# Altium schematic sheet electronic_dc_load_v1.SchDoc: Electronic DC Load (part 3 of 3)
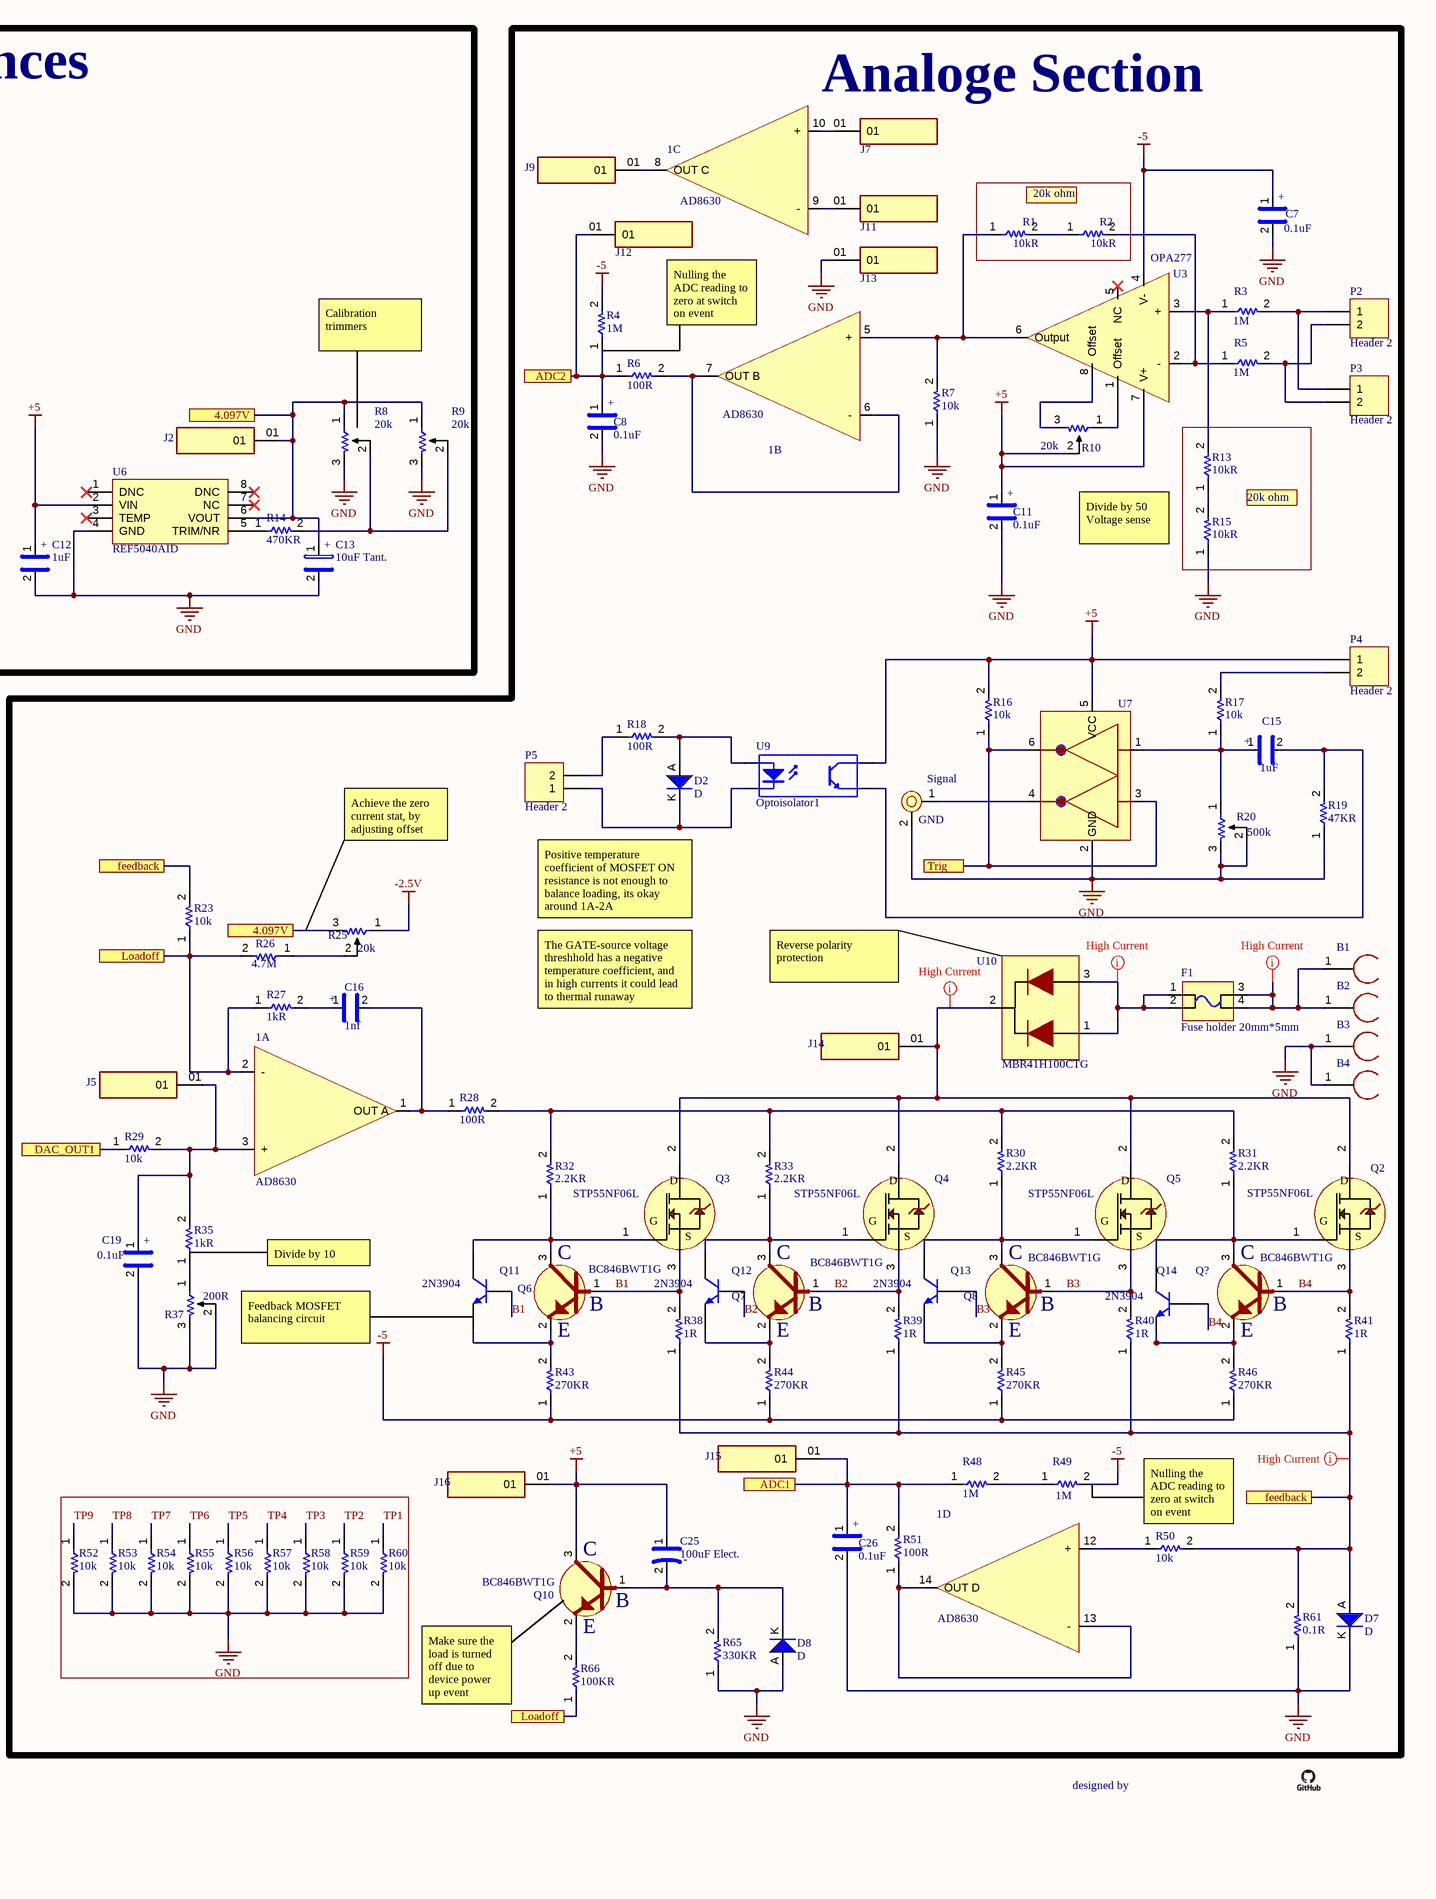
[diagram p3: electronic_dc_load_v1.SchDoc, right]

## Library data of the parts (continued)
R37 = 200R: GLOVE, POLYAMIDE, L/FREE, PU, SIZE 6 - More Details; Manufacturer: Bourns; Manufacturer Part Number: 3296Y-1-201LF; Tolerance: 10%; Power Rating: 500mW; Voltage Rating: 300V; Number of Turns: 25; Temperature Coefficient: 100ppm/°C; Lead Diameter: 0.5mm; Supplier 1: Digi-Key; RoHS: Yes; Category: Variable Resistors and Potentiometers; Stock 1: 3; Pricing 1: 1=2.41000, 10=2.11700, 25=1.89800, 50=1.82500, 100=1.75200, 250=1.67900, 500=1.38700, 1000=1.31400, 5000=1.09500 (USD); Mount: Through Hole,Panel,PCB; Weight: 0.03oz; Color: Blue; Min Operating Temperature: -55°C; Max Operating Temperature: 125°C; Resistance: 200R; Packaging: Rail/Tube; Package Quantity: 50; Voltage Rating (DC): 300V; Resistor Type: Cermet; Termination: Pin; Taper: Linear; Max Power Dissipation: 500mW; Series: 3296; Technology: CERMET; Resistance Tolerance: 10%; Length: 9.53mm; Width: 9.53mm; Height: 0.395inch; Depth: 4.83mm; Radiation Hardening: No; REACH SVHC: No SVHC; Military Standard: Not; Lead Free: Lead Free; RoHS Compliant: Yes; ComponentLink1URL: https://datasheet.ciiva.com/11831/0900766b8069ccf4-11831017.pdf?src-supplier=RSComponents; ComponentLink1Description: https://datasheet.ciiva.com/11831/0900766b8069ccf4-11831017.pdf?src-supplier=RSComponents; ComponentLink2URL: https://datasheet.ciiva.com/29122/447304-da-01-en-trimmer-tht3296y-1-201lf-200r-0-5w-29122391.pdf?src-supplier=Conrad; ComponentLink2Description: https://datasheet.ciiva.com/29122/447304-da-01-en-trimmer-tht3296y-1-201lf-200r-0-5w-29122391.pdf?src-supplier=Conrad; ComponentLink3URL: https://datasheet.ciiva.com/16716/70153578-16716822.pdf?src-supplier=Allied+Electronics; ComponentLink3Description: https://datasheet.ciiva.com/16716/70153578-16716822.pdf?src-supplier=Allied+Electronics; ComponentLink4URL: https://datasheet.ciiva.com/30066/3296-30066951.pdf?src-supplier=Onlinecomponents.com; ComponentLink4Description: https://datasheet.ciiva.com/30066/3296-30066951.pdf?src-supplier=Onlinecomponents.com; ComponentLink5URL: https://datasheet.ciiva.com/2158/3296-2158313.pdf?src-supplier=Digi-Key; ComponentLink5Description: https://datasheet.ciiva.com/2158/3296-2158313.pdf?src-supplier=Digi-Key; ComponentLink6URL: https://datasheet.ciiva.com/1131/1815117-1131451.pdf?src-supplier=Element14; ComponentLink6Description: https://datasheet.ciiva.com/1131/1815117-1131451.pdf?src-supplier=Element14; ComponentLink7URL: https://datasheet.ciiva.com/14173/dabourns3296-data-e-14173005.pdf?src-supplier=Distrelec; ComponentLink7Description: https://datasheet.ciiva.com/14173/dabourns3296-data-e-14173005.pdf?src-supplier=Distrelec; Supplier Part Number 1: 3296Y-201LF-ND
R38-R41 = 1R: RES 1 OHM 5W 1% AXIAL; Manufacturer: Vishay BCcomponents; Manufacturer Part Number: PAC500001008FAC000; Temperature Coefficient: 100ppm/°C; Supplier 1: Mouser; RoHS: Yes; Category: Through-Hole Resistors; Stock 1: 101; Pricing 1: 1=1.28000, 10=0.95500, 50=0.95500, 100=0.69800, 1000=0.48800, 10000=0.45600 (USD); Mount: Through Hole; Case/Package: Conformal; Contact Plating: Tin; Min Operating Temperature: -55°C; Max Operating Temperature: 275°C; Package Quantity: 1; Resistance: 1R; Power Rating: 5W; Tolerance: 1%; Packaging: Tape and Reel; Resistor Type: Wirewound; Number of Terminations: 2; Termination: Axial; Max Power Dissipation: 5W; Features: Flame Retardant Coating; Series: PAC; Construction: Cylindrical; Diameter: 7.5mm; Length: 26mm; Radiation Hardening: No; Military Standard: Not; RoHS Compliant: Yes; ComponentLink1URL: https://datasheet.ciiva.com/2720/pacserie-2720053.pdf?src-supplier=Digi-Key; ComponentLink1Description: https://datasheet.ciiva.com/2720/pacserie-2720053.pdf?src-supplier=Digi-Key; ComponentLink2URL: https://datasheet.ciiva.com/2720/pacserie-2720054.pdf?src-supplier=Digi-Key; ComponentLink2Description: https://datasheet.ciiva.com/2720/pacserie-2720054.pdf?src-supplier=Digi-Key; ComponentLink3URL: https://datasheet.ciiva.com/8401/pacserie-8401197.pdf?src-supplier=Avnet; ComponentLink3Description: https://datasheet.ciiva.com/8401/pacserie-8401197.pdf?src-supplier=Avnet; Supplier Part Number 1: 71-PAC500001008FAC00
R43-R46 = 270KR: 270KR ±0.1%  0.25W
R61 = 0.1R: BOURNS - PWR220T-35-R100F - RESISTOR, POWER, 0.1R, 0.01, 35W; Resistance: 100mR; Tolerance: 1%; Voltage Rating: 2kV; Threshold Voltage: 1.4V; Temperature Coefficient: 100ppm/°C; Voltage Rating (DC): 250V; Lead Diameter: 0.72mm; Supplier 1: Digi-Key; Manufacturer: Bourns; Manufacturer Part Number: PWR220T-35-R100F; RoHS: Yes; Category: Through-Hole Resistors; Stock 1: 660; Pricing 1: 1=4.48000, 10=4.05400, 100=3.01880, 1000=2.17350, 2500=2.13900 (USD); Case/Package: TO-220; Min Operating Temperature: -55°C; Max Operating Temperature: 155°C; Power Rating: 35W; Packaging: Rail/Tube; Package Quantity: 50; Resistor Type: Thick Film; Number of Terminations: 2; Termination: Radial; Max Power Dissipation: 35W; Features: Automotive AEC-Q200; Series: PWR220T-35; Resistance Tolerance: 1%; Construction: Rectangular; Technology: THICK FILM; Length: 10.1mm; Width: 0.157inch; Height: 14.6mm; Lead Pitch: 5.08mm; Depth: 4mm; REACH SVHC: No SVHC; Military Standard: Not; RoHS Compliant: Yes; ComponentLink1URL: https://datasheet.ciiva.com/7986/1869472-7986042.pdf?src-supplier=Element14; ComponentLink1Description: https://datasheet.ciiva.com/7986/1869472-7986042.pdf?src-supplier=Element14; Supplier Part Number 1: PWR220T-35-R100F-ND
R65 = 330KR: 330K ohms ±0.1%  0.25W
R66 = 100KR: 100K ±0.1%  0.25W
SW1 = SW-SPST: Single-Pole, Single-Throw Switch; Published: 24-Mar-1999; LatestRevisionDate: 17-Jul-2002; LatestRevisionNote: Re-released for DXP Platform.; PackageReference: SPST-2; Publisher: Altium Limited; PackageDescription: Switch; 2 Leads
SW2 = FSM4JSMA: Switch Tactile OFF (ON) SPST Round Button Gull Wing 0.05A 24VDC 2.6N SMD T/R; MF: {'manufacturer': u'TE Connectivity'}; Value: *; Price: None; Availability: Unavailable; Package: None; MP: FSM4JSMA
U1 = LM7812CT: Fairchild Semiconductor; Manufacturer: ON Semiconductor / Fairchild; Dropout Voltage: 2V; Quiescent Current: 8mA; Number of Outputs: 1; Max Input Voltage: 35V; Max Output Current: 1A; Output Voltage: 12V; Polarity: Positive; Accuracy: 4%; Output Type: Fixed; Min Input Voltage: 14.5V; Power Supply Rejection Ratio (PSRR): 71dB; Supplier 1: Avnet; Manufacturer Part Number: LM7812CT; RoHS: Yes; Category: Voltage Regulators - Linear; Stock 1: 6000; Mount: Through Hole; Case/Package: TO-220-3; Number of Pins: 3; Weight: 1.214g; Contact Plating: Tin,Matte; Min Operating Temperature: -40°C; Max Operating Temperature: 125°C; Output Current: 1A; Packaging: Rail/Tube; Package Quantity: 50; Number of Regulators: 1; Output Voltage Accuracy: 4%; Nominal Output Voltage: 12V; Min Output Voltage: 12V; Length: 10.16mm; Width: 4.7mm; Height: 8.89mm; Radiation Hardening: No; Lead Free: Lead Free; RoHS Compliant: Yes; REACH SVHC: No SVHC; ComponentLink1URL: https://datasheet.ciiva.com/26908/lm7812ct-26908840.pdf?src-supplier=IIIC; ComponentLink1Description: https://datasheet.ciiva.com/26908/lm7812ct-26908840.pdf?src-supplier=IIIC; ComponentLink2URL: https://datasheet.ciiva.com/2039/lm7805-2039371.pdf?src-supplier=Digi-Key; ComponentLink2Description: https://datasheet.ciiva.com/2039/lm7805-2039371.pdf?src-supplier=Digi-Key; ComponentLink3URL: https://datasheet.ciiva.com/25974/lm7812-25974492.pdf?src-supplier=Avnet+Europe; ComponentLink3Description: https://datasheet.ciiva.com/25974/lm7812-25974492.pdf?src-supplier=Avnet+Europe; Supplier Part Number 1: LM7812CT
U2 = LM7805CT: Standard Regulator Pos 5V 2.2A 3-Pin(3+Tab) TO-220AB Rail; Manufacturer: ON Semiconductor / Fairchild; Quiescent Current: 8mA; Dropout Voltage: 2V; Number of Outputs: 1; Output Current: 1A; Output Type: Fixed; Max Input Voltage: 35V; Polarity: Positive; Min Input Voltage: 7V; Accuracy: 4%; Power Supply Rejection Ratio (PSRR): 73dB; Max Output Voltage: 5.2V; Manufacturer Part Number: LM7805CT; RoHS: Yes; Category: Voltage Regulators - Linear; Stock 1: 9559; Pricing 1: 331=1.02898, 340=1.02141, 670=1.01384, 1700=1.00628, 3400=0.99871, 17000=0.99115, 34000=0.98358 (USD); Mount: Through Hole; Case/Package: TO-220-3; Number of Pins: 3; Weight: 1.214g; Min Operating Temperature: -40°C; Max Operating Temperature: 125°C; Output Voltage: 5V; Packaging: Rail/Tube; Package Quantity: 50; Max Output Current: 1A; Number of Regulators: 1; Output Voltage Accuracy: 4%; Current Rating: 1A; Nominal Output Voltage: 5V; Min Output Voltage: 5V; Length: 10.67mm; Width: 4.7mm; Height: 16.3mm; Radiation Hardening: No; RoHS Compliant: Yes; Lead Free: Lead Free; REACH SVHC: No SVHC; ComponentLink1URL: https://datasheet.ciiva.com/19456/786138-19456361.pdf?src-supplier=Jameco; ComponentLink1Description: https://datasheet.ciiva.com/19456/786138-19456361.pdf?src-supplier=Jameco; ComponentLink2URL: https://datasheet.ciiva.com/26904/lm7805ct-26904988.pdf?src-supplier=IIIC; ComponentLink2Description: https://datasheet.ciiva.com/26904/lm7805ct-26904988.pdf?src-supplier=IIIC; ComponentLink3URL: https://datasheet.ciiva.com/2039/lm7805-2039365.pdf?src-supplier=Digi-Key; ComponentLink3Description: https://datasheet.ciiva.com/2039/lm7805-2039365.pdf?src-supplier=Digi-Key; ComponentLink4URL: https://datasheet.ciiva.com/8239/lm7812-8239478.pdf?src-supplier=Avnet; ComponentLink4Description: https://datasheet.ciiva.com/8239/lm7812-8239478.pdf?src-supplier=Avnet; ComponentLink5URL: https://datasheet.ciiva.com/1512/1855686-1512106.pdf?src-supplier=Element14; ComponentLink5Description: https://datasheet.ciiva.com/1512/1855686-1512106.pdf?src-supplier=Element14; ComponentLink6URL: https://datasheet.ciiva.com/17332/lm7805-17332792.pdf?src-supplier=Future+Electronics; ComponentLink6Description: https://datasheet.ciiva.com/17332/lm7805-17332792.pdf?src-supplier=Future+Electronics; ComponentLink7URL: https://datasheet.ciiva.com/1512/1855686-1512105.pdf?src-supplier=Element14; ComponentLink7Description: https://datasheet.ciiva.com/1512/1855686-1512105.pdf?src-supplier=Element14; ComponentLink8URL: https://datasheet.ciiva.com/1511/1855686-1511835.pdf?src-supplier=Element14; ComponentLink8Description: https://datasheet.ciiva.com/1511/1855686-1511835.pdf?src-supplier=Element14; ComponentLink9URL: https://datasheet.ciiva.com/48694/001253095-da-01-en-ic-reg-ldo-5v-1a-lm7805ct-to-220-3-fsc-48694790.pdf?src-supplier=Conrad; ComponentLink9Description: https://datasheet.ciiva.com/48694/001253095-da-01-en-ic-reg-ldo-5v-1a-lm7805ct-to-220-3-fsc-48694790.pdf?src-supplier=Conrad; Supplier Part Number 1: LM7805CT; Supplier 1: Avnet
U3 = OPA277: Operational Amplifier Single 1 MHz SO-8, OPA277UA, Texas Instruments; Voltage Gain: 140dB; Nominal Supply Current: 825uA; Common Mode Rejection Ratio: 115dB; Number of Channels: 1; Slew Rate: 0.8V/µs; Input Offset Voltage (Vos): 20uV; Min Dual Supply Voltage: 2V; Max Dual Supply Voltage: 18V; Bandwidth: 1MHz; Input Bias Current: 2.8nA; Operating Supply Current: 790uA; Output Current per Channel: 35mA; Max I/O Voltage: 50uV; Dual Supply Voltage: 9V; Supplier 1: Digi-Key; Manufacturer: Texas Instruments; Manufacturer Part Number: OPA277UA; RoHS: Yes; Category: Amplifiers - Op Amps, Buffer, Instrumentation; Stock 1: 3292; Pricing 1: 1=3.72000, 10=3.34300, 25=3.16000, 100=2.73880, 250=2.59832, 500=2.33148, 1000=2.21275 (USD); Case/Package: D; Number of Pins: 8; Contact Plating: Gold; Min Operating Temperature: -40°C; Max Operating Temperature: 85°C; Package Quantity: 75; Packaging: Rail/Tube; Number of Circuits: 1; Gain Bandwidth Product: 1MHz; Number of Elements: 1; Unity Gain Bandwidth Product: 1MHz; Nominal Gain Bandwidth Product: 1MHz; Max Supply Voltage: 18V; Number of Amplifiers: 1; Length: 4.9mm; Width: 3.91mm; Height: 1.58mm; Radiation Hardening: No; Lead Free: Lead Free; RoHS Compliant: Yes; REACH SVHC: No SVHC; ComponentLink1URL: https://datasheet.ciiva.com/2973/opa4277-2973984.pdf?src-supplier=Avnet; ComponentLink1Description: https://datasheet.ciiva.com/2973/opa4277-2973984.pdf?src-supplier=Avnet; ComponentLink2URL: https://datasheet.ciiva.com/1799/opa277-1799267.pdf?src-supplier=Digi-Key; ComponentLink2Description: https://datasheet.ciiva.com/1799/opa277-1799267.pdf?src-supplier=Digi-Key; ComponentLink3URL: https://datasheet.ciiva.com/7738/1830880-7738390.pdf?src-supplier=Element14; ComponentLink3Description: https://datasheet.ciiva.com/7738/1830880-7738390.pdf?src-supplier=Element14; ComponentLink4URL: https://datasheet.ciiva.com/26243/opa4277-26243593.pdf?src-supplier=Avnet+Europe; ComponentLink4Description: https://datasheet.ciiva.com/26243/opa4277-26243593.pdf?src-supplier=Avnet+Europe; Supplier Part Number 1: OPA277UA-ND
U4 = LM431ACMX: V-Ref Adjustable 2.5V to 36V 100mA 8-Pin SOP T/R; Manufacturer: ON Semiconductor / Fairchild; Number of Channels: 1; Tolerance: 2%; Temperature Coefficient: 50ppm/°C; Cathode Current: 1mA; Reference Type: Shunt,Adjustable; Supplier 1: Avnet; Manufacturer Part Number: LM431ACMX; RoHS: Yes; Category: Voltage References; Stock 1: 40099; Mount: Surface Mount; Case/Package: SOP; Number of Pins: 8; Weight: 0.2304g; Min Operating Temperature: -25°C; Max Operating Temperature: 85°C; Max Input Voltage: 36V; Packaging: Tape and Reel; Package Quantity: 3000; Output Voltage: 36V; Max Output Current: 100mA; Max Output Voltage: 36V; Output Current: 100mA; Current Rating: 100mA; Series: -; Min Output Voltage: 2.5V; Output Type: Adjustable; RoHS Compliant: Yes; Lead Free: Lead Free; ComponentLink1URL: https://datasheet.ciiva.com/4908/lm431a-189989-4908452.pdf?src-supplier=Mouser; ComponentLink1Description: https://datasheet.ciiva.com/4908/lm431a-189989-4908452.pdf?src-supplier=Mouser; ComponentLink2URL: https://datasheet.ciiva.com/29571/lm431a-29571926.pdf?src-supplier=Digi-Key; ComponentLink2Description: https://datasheet.ciiva.com/29571/lm431a-29571926.pdf?src-supplier=Digi-Key; ComponentLink3URL: https://datasheet.ciiva.com/29571/lm431a-29571925.pdf?src-supplier=Digi-Key; ComponentLink3Description: https://datasheet.ciiva.com/29571/lm431a-29571925.pdf?src-supplier=Digi-Key; ComponentLink4URL: https://datasheet.ciiva.com/9215/lm431c-9215048.pdf?src-supplier=Avnet; ComponentLink4Description: https://datasheet.ciiva.com/9215/lm431c-9215048.pdf?src-supplier=Avnet; Supplier Part Number 1: LM431ACMX
U5 = LTC1046: LINEAR TECHNOLOGY - LTC1046CS8#PBF - VOLT CONVERTER, SMD, SOIC8, 1046; Manufacturer: Analog Devices / Linear Technology; Number of Outputs: 1; Output Voltage: 3V; Output Current: 50mA; Synchronous Rectifier: No; Min Input Voltage: 1.5V; Switching Frequency: 30kHz; Max Input Voltage: 6V; Operating Supply Current: 165uA; Output Type: Adjustable; Min Output Voltage: -6V; Max Output Voltage: -1.5V; Supplier 1: Digi-Key; Manufacturer Part Number: LTC1046CS8#PBF; RoHS: Yes; Category: Voltage Regulators - Switching; Stock 1: 46; Pricing 1: 1=6.96000, 10=6.29000, 25=5.99760, 100=5.20760, 250=4.97352, 500=4.53468, 1000=4.14000 (USD); Case/Package: SOIC; Number of Pins: 8; Min Operating Temperature: 0°C; Max Operating Temperature: 70°C; Packaging: Cut Tape; Package Quantity: 100; Series: -; Max Output Current: 50mA; Max Supply Voltage: 6V; Min Supply Voltage: 1.5V; Length: 5mm; Width: 3.988mm; Height: 1.498mm; Radiation Hardening: No; RoHS Compliant: Yes; Lead Free: Lead Free; REACH SVHC: No SVHC; ComponentLink1URL: https://datasheet.ciiva.com/2024/2898-2024864.pdf?src-supplier=Digi-Key; ComponentLink1Description: https://datasheet.ciiva.com/2024/2898-2024864.pdf?src-supplier=Digi-Key; ComponentLink2URL: https://datasheet.ciiva.com/30477/0900766b8125257c-30477616.pdf?src-supplier=RSComponents; ComponentLink2Description: https://datasheet.ciiva.com/30477/0900766b8125257c-30477616.pdf?src-supplier=RSComponents; ComponentLink3URL: https://datasheet.ciiva.com/15114/getdatasheetpartid-135603-15114038.pdf?src-supplier=Verical; ComponentLink3Description: https://datasheet.ciiva.com/15114/getdatasheetpartid-135603-15114038.pdf?src-supplier=Verical; ComponentLink4URL: https://datasheet.ciiva.com/19474/1745629-19474318.pdf?src-supplier=Jameco; ComponentLink4Description: https://datasheet.ciiva.com/19474/1745629-19474318.pdf?src-supplier=Jameco; ComponentLink5URL: https://datasheet.ciiva.com/26898/ltc1046cs8-pbf-26898654.pdf?src-supplier=IIIC; ComponentLink5Description: https://datasheet.ciiva.com/26898/ltc1046cs8-pbf-26898654.pdf?src-supplier=IIIC; ComponentLink6URL: https://datasheet.ciiva.com/6185/1573420-6185372.pdf?src-supplier=Farnell; ComponentLink6Description: https://datasheet.ciiva.com/6185/1573420-6185372.pdf?src-supplier=Farnell; Supplier Part Number 1: LTC1046CS8#PBF-ND
U6 = REF5040AID: IC VREF SERIES 4.096V 8SOIC; Manufacturer: Texas Instruments; Max Input Voltage: 18V; Max Output Current: 10mA; Min Input Voltage: 4.296V; Tolerance: 0.1%; Temperature Coefficient: 3ppm/°C; Quiescent Current: 1mA; Reference Type: Series,Fixed; Number of Channels: 1; Operating Supply Current: 800uA; Operating Supply Voltage: 24V; Supplier 1: Mouser; Manufacturer Part Number: REF5040AID; RoHS: Yes; Category: Voltage References; Stock 1: 277; Pricing 1: 1=4.08000, 10=3.67000, 50=3.47000, 100=3.47000, 1000=3.47000, 10000=3.47000 (USD); Case/Package: D; Number of Pins: 8; Weight: 0.002677oz; Min Operating Temperature: -40°C; Max Operating Temperature: 125°C; Output Voltage: 4.096V; Packaging: Rail/Tube; Package Quantity: 75; Output Current: 10mA; Max Output Voltage: 4.096V; Reference Voltage: 4.096V; Length: 5mm; Width: 4mm; Height: 1.5mm; Radiation Hardening: No; Lead Free: Lead Free; RoHS Compliant: Yes; REACH SVHC: No SVHC; ComponentLink1URL: https://datasheet.ciiva.com/2007/ref5020-2007515.pdf?src-supplier=Digi-Key; ComponentLink1Description: https://datasheet.ciiva.com/2007/ref5020-2007515.pdf?src-supplier=Digi-Key; ComponentLink2URL: https://datasheet.ciiva.com/3235/ref5050-3235581.pdf?src-supplier=Avnet; ComponentLink2Description: https://datasheet.ciiva.com/3235/ref5050-3235581.pdf?src-supplier=Avnet; Supplier Part Number 1: 595-REF5040AID
U7 = SN74LVC2G14DBVR: INVERTER SCHMITT TRIGGER, SOT-23-6, FULL REEL; Logic Type:Inverter Schmitt Trigger; Output Current:32mA; No. of Inputs:1; Supply Voltage Min:1.65V; Supply Voltage Max:5.5V; Logic Case Style:SOT-23; No. of Pins:6; Family Type:LVC ;RoHS Compliant: Yes; Manufacturer: Texas Instruments; Number of Inputs: 1; Propagation Delay: 9.5ns; Max Supply Voltage: 5.5V; Min Supply Voltage: 1.65V; Output Current: 32mA; Logic Function: Buffer,Inverter,Inverting,Schmitt Trigger; Number of Elements: 2; Quiescent Current: 10uA; High Level Output Current: -32mA; Turn-On Delay Time: 4.3ns; Supplier 1: Digi-Key; Manufacturer Part Number: SN74LVC2G14DBVR; RoHS: Yes; Category: Logic Gates; Stock 1: 686; Pricing 1: 1=0.43000, 10=0.32300, 25=0.29160, 100=0.20140, 250=0.16960, 500=0.13780, 1000=0.10600 (USD); Mount: Surface Mount; Case/Package: SOT-23; Number of Pins: 6; Weight: 0.000557oz; Contact Plating: Tin,Matte; Min Operating Temperature: -40°C; Max Operating Temperature: 125°C; Package Quantity: 3000; Packaging: Tape and Reel; Max Output Current: 32mA; Number of Circuits: 2; Low Level Output Current: 32mA; Termination: SMD/SMT; Number of Gates: 2; Number of Bits: 2; Schmitt Trigger Input: Yes; Length: 2.9mm; Width: 1.6mm; Height: 1.15mm; Radiation Hardening: No; REACH SVHC: No SVHC; Lead Free: Lead Free; RoHS Compliant: Yes; ComponentLink1URL: https://datasheet.ciiva.com/4827/sn74lvc2g14-50958-4827361.pdf?src-supplier=Mouser; ComponentLink1Description: https://datasheet.ciiva.com/4827/sn74lvc2g14-50958-4827361.pdf?src-supplier=Mouser; ComponentLink2URL: https://datasheet.ciiva.com/28540/1772571-28540805.pdf?src-supplier=Element14; ComponentLink2Description: https://datasheet.ciiva.com/28540/1772571-28540805.pdf?src-supplier=Element14; ComponentLink3URL: https://datasheet.ciiva.com/15089/getdatasheetpartid-44147-15089068.pdf?src-supplier=Verical; ComponentLink3Description: https://datasheet.ciiva.com/15089/getdatasheetpartid-44147-15089068.pdf?src-supplier=Verical; ComponentLink4URL: https://datasheet.ciiva.com/34301/1046238-34301917.pdf?src-supplier=Jameco; ComponentLink4Description: https://datasheet.ciiva.com/34301/1046238-34301917.pdf?src-supplier=Jameco; ComponentLink5URL: https://datasheet.ciiva.com/1864/sn74lvc2g14-1864305.pdf?src-supplier=Digi-Key; ComponentLink5Description: https://datasheet.ciiva.com/1864/sn74lvc2g14-1864305.pdf?src-supplier=Digi-Key; ComponentLink6URL: https://datasheet.ciiva.com/1864/sn74lvc2g14-1864306.pdf?src-supplier=Digi-Key; ComponentLink6Description: https://datasheet.ciiva.com/1864/sn74lvc2g14-1864306.pdf?src-supplier=Digi-Key; ComponentLink7URL: https://datasheet.ciiva.com/1864/sn74lvc2g14-1864307.pdf?src-supplier=Digi-Key; ComponentLink7Description: https://datasheet.ciiva.com/1864/sn74lvc2g14-1864307.pdf?src-supplier=Digi-Key; ComponentLink8URL: https://datasheet.ciiva.com/14288/sn74lvc2g14-14288309.pdf?src-supplier=Avnet; ComponentLink8Description: https://datasheet.ciiva.com/14288/sn74lvc2g14-14288309.pdf?src-supplier=Avnet; ComponentLink9URL: https://datasheet.ciiva.com/26042/sn74lvc2g14-26042406.pdf?src-supplier=Avnet+Europe; ComponentLink9Description: https://datasheet.ciiva.com/26042/sn74lvc2g14-26042406.pdf?src-supplier=Avnet+Europe; ComponentLink10URL: https://datasheet.ciiva.com/7783/1768119-7783611.pdf?src-supplier=Element14; ComponentLink10Description: https://datasheet.ciiva.com/7783/1768119-7783611.pdf?src-supplier=Element14; ComponentLink11URL: https://datasheet.ciiva.com/7783/1768119-7783612.pdf?src-supplier=Element14; ComponentLink11Description: https://datasheet.ciiva.com/7783/1768119-7783612.pdf?src-supplier=Element14; Supplier Part Number 1: 296-13010-1-ND
U8 = GLCD: Grapghic LCD based  on st7920  controller  128x64
U9 U11 = Optoisolator1: 4-Pin Phototransistor Optocoupler; Published: 24-Mar-1999; LatestRevisionDate: 04-Mar-2005; LatestRevisionNote: Sch pins 3 & 4 Swapped.; DatasheetVersion: Nov-2003; PackageReference: DIP-4; Publisher: Altium Limited
U10 = MBR41H100CTG: DIODE ARRAY SCHOTTKY 100V TO220; Manufacturer: ON Semiconductor; Forward Current: 20A; Max Reverse Current: 10uA; Max Surge Current: 350A; Forward Voltage: 900mV; Element Configuration: Common Cathode; Supplier 1: Digi-Key; Manufacturer Part Number: MBR41H100CTG; RoHS: Yes; Category: Schottky Diodes; Stock 1: 220; Pricing 1: 1=2.14000, 10=1.92400, 100=1.54640, 500=1.27050, 1000=1.05270, 2000=0.99000 (USD); Case/Package: TO-220-3; Number of Pins: 3; Min Operating Temperature: -65°C; Max Operating Temperature: 175°C; Package Quantity: 50; Packaging: Rail/Tube; Average Rectified Current: 20A; Max Reverse Leakage Current: 10uA; Max Repetitive Reverse Voltage (Vrrm): 100V; Peak Non-Repetitive Surge Current: 350A; Max Forward Surge Current (Ifsm): 350A; Current Rating: 20A; Voltage Rating (DC): 100V; Max Reverse Voltage (DC): 100V; Series: SWITCHMODE™; Length: 10.28mm; Width: 4.82mm; Height: 15.75mm; Radiation Hardening: No; REACH SVHC: No SVHC; Lead Free: Lead Free; RoHS Compliant: Yes; ComponentLink1URL: https://datasheet.ciiva.com/908/mbr41h100ct-d-908465.pdf?src-supplier=Avnet; ComponentLink1Description: https://datasheet.ciiva.com/908/mbr41h100ct-d-908465.pdf?src-supplier=Avnet; ComponentLink2URL: https://datasheet.ciiva.com/30479/0900766b812212ba-30479299.pdf?src-supplier=RSComponents; ComponentLink2Description: https://datasheet.ciiva.com/30479/0900766b812212ba-30479299.pdf?src-supplier=RSComponents; ComponentLink3URL: https://datasheet.ciiva.com/7962/mbr41h100ct-d-7962757.pdf?src-supplier=Element14; ComponentLink3Description: https://datasheet.ciiva.com/7962/mbr41h100ct-d-7962757.pdf?src-supplier=Element14; ComponentLink4URL: https://datasheet.ciiva.com/16362/mbr41h100ct-d-16362069.pdf?src-supplier=Future+Electronics; ComponentLink4Description: https://datasheet.ciiva.com/16362/mbr41h100ct-d-16362069.pdf?src-supplier=Future+Electronics; ComponentLink5URL: https://datasheet.ciiva.com/908/mbr41h100ct-d-908438.pdf?src-supplier=Digi-Key; ComponentLink5Description: https://datasheet.ciiva.com/908/mbr41h100ct-d-908438.pdf?src-supplier=Digi-Key; Supplier Part Number 1: MBR41H100CTGOS-ND
U21 = PIC16F1779: IC MCU 8BIT 28KB FLASH 44TQFP; Manufacturer: Microchip; Manufacturer Part Number: PIC16F1779-I/PT; Frequency: 32MHz; Interface: I2C,SPI,UART,USART,LIN; Number of I/Os: 36; Oscillator Type: Internal; Peripherals: Brown-out Detect/Reset,POR,PWM,WDT; Core Architecture: PIC; RAM Size: 2KB; Min Supply Voltage: 2.3V; Max Supply Voltage: 5.5V; Supplier 1: RSComponents; RoHS: Yes; Category: Microcontrollers; Stock 1: 232; Pricing 1: 10=3.22200, 24=3.14200, 100=3.06100 (USD); Case/Package: TQFP; Number of Pins: 44; Min Operating Temperature: -40°C; Max Operating Temperature: 85°C; Memory Type: FLASH; Memory Size: 28KB; Packaging: Tray; RoHS Compliant: Yes; REACH SVHC: No SVHC; ComponentLink1URL: http://www.farnell.com/datasheets/2245186.pdf?src-supplier=Farnell; ComponentLink1Description: http://www.farnell.com/datasheets/2245186.pdf?src-supplier=Farnell; ComponentLink2URL: http://www.mouser.com/ds/2/268/40001819B-1066584.pdf?src-supplier=Mouser; ComponentLink2Description: http://www.mouser.com/ds/2/268/40001819B-1066584.pdf?src-supplier=Mouser; ComponentLink3URL: http://www.microchip.com/mymicrochip/filehandler.aspx?ddocname=en584356&src-supplier=Digi-Key; ComponentLink3Description: http://www.microchip.com/mymicrochip/filehandler.aspx?ddocname=en584356&src-supplier=Digi-Key; ComponentLink4URL: http://www.farnell.com/datasheets/1993941.pdf?src-supplier=Element14; ComponentLink4Description: http://www.farnell.com/datasheets/1993941.pdf?src-supplier=Element14; Supplier Part Number 1: 9125338P
U23 = 27899: SWITCH KEYPAD 16 KEY NON-ILLUM; Manufacturer: Parallax; Max Current Rating: 30mA; Illumination Type: Non-Illuminated; Supplier 1: Digi-Key; Manufacturer Part Number: 27899; RoHS: Yes; Category: Screw and Nut Drivers; Stock 1: 50; Pricing 1: 1=7.41000 (USD); Mount: Panel,Front; Package Quantity: 1; Termination: Connector; ComponentLink1URL: https://datasheet.ciiva.com/19453/2161473-19453254.pdf?src-supplier=Jameco; ComponentLink1Description: https://datasheet.ciiva.com/19453/2161473-19453254.pdf?src-supplier=Jameco; ComponentLink2URL: https://datasheet.ciiva.com/12466/27899-4x4matrixmembranekeypad-v1-2-33055-12466600.pdf?src-supplier=Mouser; ComponentLink2Description: https://datasheet.ciiva.com/12466/27899-4x4matrixmembranekeypad-v1-2-33055-12466600.pdf?src-supplier=Mouser; Supplier Part Number 1: 27899PAR-ND
U24 = LM35DZ: TEXAS INSTRUMENTS         LM35DZ            Temperature Sensor IC, Voltage,  0.4C, +2 C, +100 C, TO-92, 3 Pins; Manufacturer: TI National Semiconductor; Min Supply Voltage: 4V; Max Supply Voltage: 30V; Interface: Serial,2-Wire; Output Type: Analog; Quiescent Current: 56uA; Output Current: 10mA; Nominal Supply Current: 91.5uA; Operating Supply Current: 80uA; Output Voltage: 6V; Supplier 1: Newark; Manufacturer Part Number: LM35DZ; RoHS: No; Category: Temperature and Humidity Sensors; Mount: Through Hole; Case/Package: TO-92; Number of Pins: 3; Min Operating Temperature: 0°C; Max Operating Temperature: 100°C; Packaging: Bulk; Series: LM35; Max Supply Voltage (DC): 30V; Min Supply Voltage (DC): 4V; Supply Current: 91.5uA; Length: 5.2mm; Width: 4.19mm; Height: 5.2mm; Lead Free: Contains Lead; RoHS Compliant: No; REACH SVHC: No SVHC; ComponentLink1URL: https://datasheet.ciiva.com/27746/82-1000e-27746599.pdf?src-supplier=Rapid+Electronics; ComponentLink1Description: https://datasheet.ciiva.com/27746/82-1000e-27746599.pdf?src-supplier=Rapid+Electronics; ComponentLink2URL: https://datasheet.ciiva.com/1166/1896190-1166283.pdf?src-supplier=Element14; ComponentLink2Description: https://datasheet.ciiva.com/1166/1896190-1166283.pdf?src-supplier=Element14; Supplier Part Number 1: 92F288
U25 = PCF8574ADWR: I2C GPIO Expander 6V 16-Pin SOIC T/R; Manufacturer: Texas Instruments; Number of I/Os: 8; Frequency: 100kHz; Min Supply Voltage: 2.5V; Supplier 1: Digi-Key; Manufacturer Part Number: PCF8574ADWR; RoHS: Yes; Category: Interface ICs; Stock 1: 5886; Pricing 1: 1=1.72000, 10=1.54200, 25=1.46320, 100=1.20190, 250=1.12356, 500=0.99290, 1000=0.82331 (USD); Case/Package: SOIC; Number of Pins: 16; Weight: 0.014829oz; Contact Plating: Gold; Min Operating Temperature: -40°C; Max Operating Temperature: 85°C; Package Quantity: 1; Packaging: Tape and Reel; Max Frequency: 100kHz; Series: -; Number of Outputs: 8; Max Supply Voltage: 6V; Number of Bits: 8; Termination: SMD/SMT; Lead Free: Lead Free; RoHS Compliant: Yes; REACH SVHC: No SVHC; ComponentLink1URL: https://datasheet.ciiva.com/1780/pcf8574a-1780193.pdf?src-supplier=Digi-Key; ComponentLink1Description: https://datasheet.ciiva.com/1780/pcf8574a-1780193.pdf?src-supplier=Digi-Key; ComponentLink2URL: https://datasheet.ciiva.com/1780/pcf8574a-1780194.pdf?src-supplier=Digi-Key; ComponentLink2Description: https://datasheet.ciiva.com/1780/pcf8574a-1780194.pdf?src-supplier=Digi-Key; ComponentLink3URL: https://datasheet.ciiva.com/1780/pcf8574a-1780195.pdf?src-supplier=Digi-Key; ComponentLink3Description: https://datasheet.ciiva.com/1780/pcf8574a-1780195.pdf?src-supplier=Digi-Key; ComponentLink4URL: https://datasheet.ciiva.com/3149/pcf8574a-3149367.pdf?src-supplier=Avnet; ComponentLink4Description: https://datasheet.ciiva.com/3149/pcf8574a-3149367.pdf?src-supplier=Avnet; ComponentLink5URL: https://datasheet.ciiva.com/46411/1768199-46411463.pdf?src-supplier=Element14; ComponentLink5Description: https://datasheet.ciiva.com/46411/1768199-46411463.pdf?src-supplier=Element14; ComponentLink6URL: https://datasheet.ciiva.com/3148/pcf8574a-3148520.pdf?src-supplier=Avnet; ComponentLink6Description: https://datasheet.ciiva.com/3148/pcf8574a-3148520.pdf?src-supplier=Avnet; Supplier Part Number 1: 296-13105-1-ND
Y1 = ABM7-16.000MHZ-D2Y-T: Crystal 22.1184MHz Ã‚Â±20ppm (Tol) Ã‚Â±30ppm (Stability) 18pF FUND 50Ohm 2-Pin Mini-CSMD T/R; MF: {'manufacturer': u'Abracon LLC'}; Value: *; Package: None; Price: None; MP: ABM7-16.000MHZ-D2Y-T; Availability: Unavailable